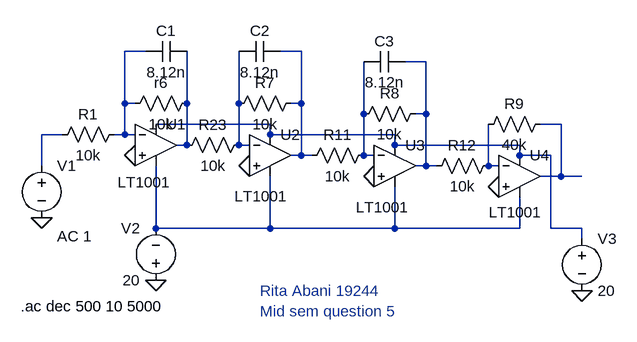
[diagram p0: schematic RitaQuestion5.asc]
RitaQuestion5.asc, the LTspice schematic file:
Version 4
SHEET 1 880 680
WIRE -48 32 -80 32
WIRE 192 32 160 32
WIRE 384 48 352 48
WIRE -80 112 -80 32
WIRE -64 112 -80 112
WIRE 16 112 16 32
WIRE 96 112 96 32
WIRE 192 112 192 32
WIRE 192 112 176 112
WIRE 288 128 288 48
WIRE 384 128 384 48
WIRE 384 128 368 128
WIRE 144 144 -32 144
WIRE 592 144 560 144
WIRE -176 160 -208 160
WIRE -80 160 -80 112
WIRE -80 160 -96 160
WIRE -64 160 -80 160
WIRE 144 160 144 144
WIRE 336 160 144 160
WIRE 16 176 16 112
WIRE 16 176 0 176
WIRE 96 176 96 112
WIRE 112 176 96 176
WIRE 336 176 336 160
WIRE 528 176 336 176
WIRE 192 192 192 112
WIRE 192 192 176 192
WIRE 208 192 192 192
WIRE 288 192 288 128
WIRE 304 192 288 192
WIRE 528 192 528 176
WIRE 576 192 528 192
WIRE -208 208 -208 160
WIRE 384 208 384 128
WIRE 384 208 368 208
WIRE 400 208 384 208
WIRE 480 208 480 144
WIRE 496 208 480 208
WIRE 592 224 592 144
WIRE 592 224 560 224
WIRE 624 224 592 224
WIRE -32 304 -32 208
WIRE 144 304 144 224
WIRE 144 304 -32 304
WIRE 336 304 336 240
WIRE 336 304 144 304
WIRE 528 304 528 256
WIRE 528 304 336 304
WIRE 576 304 576 192
WIRE 624 304 576 304
WIRE 624 320 624 304
FLAG -64 192 0
FLAG 112 208 0
FLAG 304 224 0
FLAG 496 240 0
FLAG -32 384 0
FLAG 624 400 0
FLAG -208 288 0
SYMBOL OpAmps\\LT1001 -32 112 R0
WINDOW 3 -59 121 Left 2
SYMATTR InstName U1
SYMBOL OpAmps\\LT1001 144 128 R0
WINDOW 3 -55 127 Left 2
SYMATTR InstName U2
SYMBOL OpAmps\\LT1001 336 144 R0
WINDOW 3 -60 128 Left 2
SYMATTR InstName U3
SYMBOL OpAmps\\LT1001 528 160 R0
WINDOW 3 -47 119 Left 2
SYMATTR InstName U4
SYMBOL res 112 160 R90
WINDOW 0 0 56 VBottom 2
WINDOW 3 32 56 VTop 2
SYMATTR InstName R23
SYMATTR Value 10k
SYMBOL res 304 176 R90
WINDOW 0 0 56 VBottom 2
WINDOW 3 32 56 VTop 2
SYMATTR InstName R11
SYMATTR Value 10k
SYMBOL res 496 192 R90
WINDOW 0 0 56 VBottom 2
WINDOW 3 32 56 VTop 2
SYMATTR InstName R12
SYMATTR Value 10k
SYMBOL res 32 96 R90
WINDOW 0 0 56 VBottom 2
WINDOW 3 32 56 VTop 2
SYMATTR InstName r6
SYMATTR Value 10k
SYMBOL res 192 96 R90
WINDOW 0 0 56 VBottom 2
WINDOW 3 32 56 VTop 2
SYMATTR InstName R7
SYMATTR Value 10k
SYMBOL res 384 112 R90
WINDOW 0 0 56 VBottom 2
WINDOW 3 32 56 VTop 2
SYMATTR InstName R8
SYMATTR Value 10k
SYMBOL res 576 128 R90
WINDOW 0 0 56 VBottom 2
WINDOW 3 32 56 VTop 2
SYMATTR InstName R9
SYMATTR Value 40k
SYMBOL cap 16 16 R90
WINDOW 0 0 32 VBottom 2
WINDOW 3 32 32 VTop 2
SYMATTR InstName C1
SYMATTR Value 8.12n
SYMBOL cap 160 16 R90
WINDOW 0 0 32 VBottom 2
WINDOW 3 32 32 VTop 2
SYMATTR InstName C2
SYMATTR Value 8.12n
SYMBOL cap 352 32 R90
WINDOW 0 0 32 VBottom 2
WINDOW 3 32 32 VTop 2
SYMATTR InstName C3
SYMATTR Value 8.12n
SYMBOL res -80 144 R90
WINDOW 0 0 56 VBottom 2
WINDOW 3 32 56 VTop 2
SYMATTR InstName R1
SYMATTR Value 10k
SYMBOL voltage -208 192 R0
WINDOW 123 24 124 Left 2
WINDOW 39 0 0 Left 0
SYMATTR Value2 AC 1
SYMATTR InstName V1
SYMATTR Value ""
SYMBOL voltage 624 304 R0
WINDOW 123 0 0 Left 0
WINDOW 39 0 0 Left 0
SYMATTR InstName V3
SYMATTR Value 20
SYMBOL voltage -32 400 R180
WINDOW 0 24 96 Left 2
WINDOW 3 24 16 Left 2
WINDOW 123 0 0 Left 0
WINDOW 39 0 0 Left 0
SYMATTR InstName V2
SYMATTR Value 20
TEXT -240 424 Left 2 !.ac dec 500 10 5000
TEXT 128 400 Left 2 ;Rita Abani 19244
TEXT 128 432 Left 2 ;Mid sem question 5

The netlist it stands for:
* RitaQuestion5.asc
XU1 0 N001 N007 N011 N004 LT1001  ; pins In+ In- V+ V- OUT
XU2 0 N005 N007 N011 N002 LT1001  ; pins In+ In- V+ V- OUT
XU3 0 N006 N007 N011 N003 LT1001  ; pins In+ In- V+ V- OUT
XU4 0 N010 N007 N011 N008 LT1001  ; pins In+ In- V+ V- OUT
R23 N005 N004 10k
R11 N006 N002 10k
R12 N010 N003 10k
r6 N004 N001 10k
R7 N002 N005 10k
R8 N003 N006 10k
R9 N008 N010 40k
C1 N004 N001 8.12n
C2 N002 N005 8.12n
C3 N003 N006 8.12n
R1 N001 N009 10k
V1 N009 0 AC 1
V3 N007 0 20
V2 0 N011 20
.ac dec 500 10 5000
* Rita Abani 19244
* Mid sem question 5
.lib LTC.lib
.backanno
.end